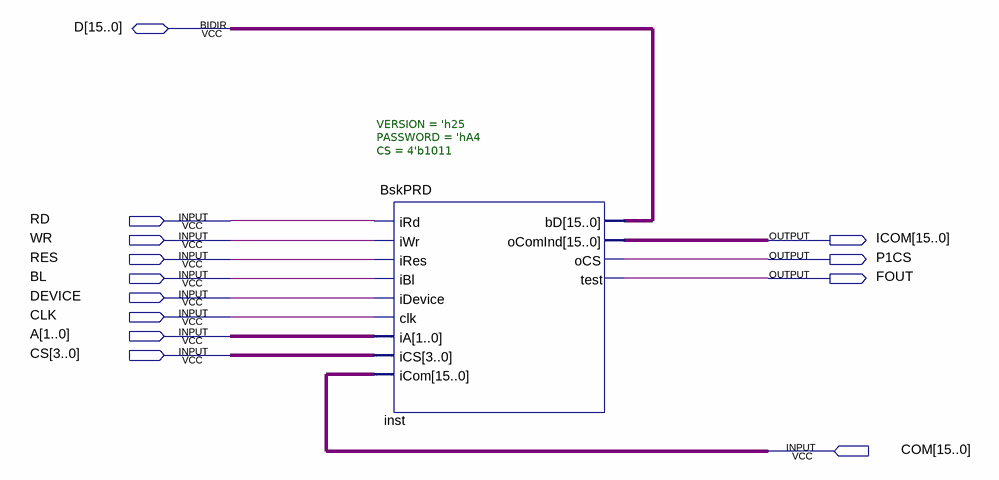
[diagram p0: schematic sheet]
// Quartus schematic Plis_Bsk_Prd_v2_06.bdf as structural Verilog: 1 symbols, 13 pins
module Plis_Bsk_Prd_v2_06 (
  input  RD,
  input  WR,
  input  RES,
  input  BL,
  input  DEVICE,
  input  CLK,
  input  [1:0] A,
  input  [3:0] CS,
  input  [15:0] COM,
  inout  [15:0] D,
  output [15:0] ICOM,
  output P1CS,
  output FOUT
);

  BskPRD #(.VERSION('h25), .PASSWORD('hA4), .CS(4'b1011)) inst (
    .iRd(RD), .iWr(WR), .iRes(RES), .iBl(BL), .iDevice(DEVICE), .clk(CLK), .iA(A), .iCS(CS), .iCom(COM),
    .oComInd(ICOM), .oCS(P1CS), .test(FOUT), .bD(D));
endmodule
